# EAGLE design untitled (EAGLE 8.5.2)

## Sheet 1 of 3
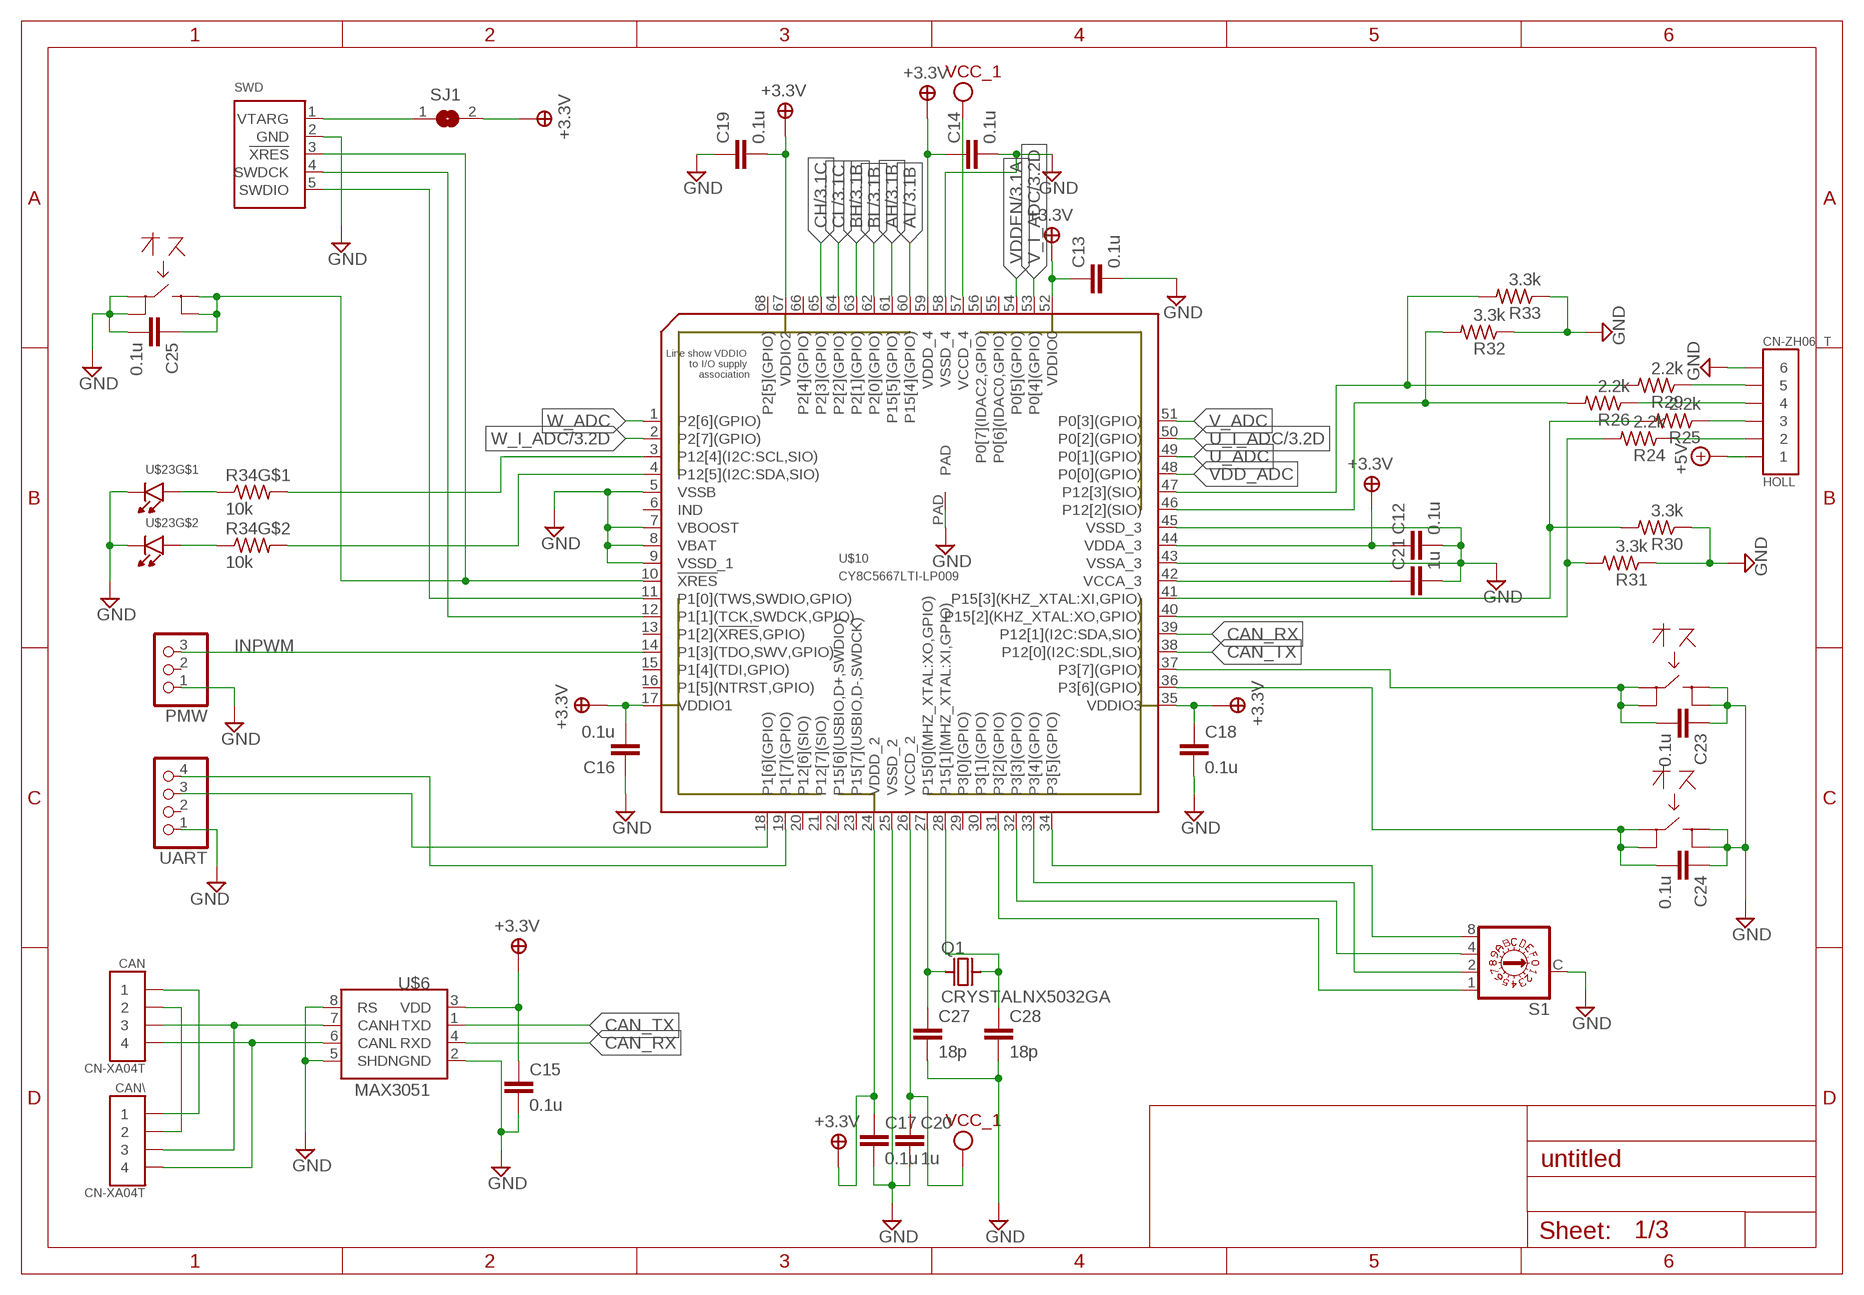
[diagram p0: schematic, sheet 1]

### Parts
C12  0.1u  CAPACITOR_1005M  [C1005]
C13  0.1u  CAPACITOR_1005M  [C1005]
C14  0.1u  CAPACITOR_1005M  [C1005]
C15  0.1u  CAPACITOR_1005M  [C1005]
C16  0.1u  CAPACITOR_1005M  [C1005]
C17  0.1u  CAPACITOR_1005M  [C1005]
C18  0.1u  CAPACITOR_1005M  [C1005]
C19  0.1u  CAPACITOR_1005M  [C1005]
C20  1u  CAPACITOR_1608M  [C1608]
C21  1u  CAPACITOR_1608M  [C1608]
C23  0.1u  CAPACITOR_1005M  [C1005]
C24  0.1u  CAPACITOR_1005M  [C1005]
C25  0.1u  CAPACITOR_1005M  [C1005]
C27  18p  CAPACITOR_1608M  [C1608]
C28  18p  CAPACITOR_1608M  [C1608]
CAN  CN-XA04T  [XA04]
CAN\  CN-XA04T  [XA04]
HOLL  CN-ZH06_T  [ZH06]
PMW  PINHD-1X03_2.54-S  [1X03-S]
Q1  CRYSTALNX5032GA  [NX5032GA]
R24  2.2k  R_1005  [R1005]
R25  2.2k  R_1005  [R1005]
R26  2.2k  R_1005  [R1005]
R29  2.2k  R_1005  [R1005]
R30  3.3k  R_1005  [R1005]
R31  3.3k  R_1005  [R1005]
R32  3.3k  R_1005  [R1005]
R33  3.3k  R_1005  [R1005]
R34  10k  R2_0402  [R1005*2]
RESET  SWITCH_4PALPS  [SKRP]
S1  P103_AKI  [SW_ROT_5]
SJ1  SJ  [SJ]
SWD  WRITE-FOR-PSOC3/4/5LP_ZH  [ZH05]
U$6  MAX3051  [SOIC8]
U$10  CY8C5667LTI-LP009  CY8C58LP_68  [QFN68_8X8]
U$23  LED2_SML522  [LED1315]
UART  PINHD-1X04_2.54-S  [1X04-S]
USER1  SWITCH_4PALPS  [SKRP]
USER2  SWITCH_4PALPS  [SKRP]

### Nets
3.3V: C12.1 C13.1 C14.1 C15.1 C16.2 C17.1 C18.1 C19.2 SJ1.2 U$6.3(VDD) U$10.17(VDDIO1) U$10.24(VDDD_2) U$10.35(VDDIO3) U$10.44(VDDA_3) U$10.52(VDDIO0) U$10.59(VDDD_4) U$10.67(VDDIO2) ; supply symbol labelled +3.3V ; also sheet 2,3
+5V: HOLL.1 ; also sheet 2
AH: U$10.61(P15[5](GPIO)) ; also sheet 3
AL: U$10.60(P15[4](GPIO)) ; also sheet 3
BH: U$10.63(P2[1](GPIO)) ; also sheet 3
BL: U$10.62(P2[0](GPIO)) ; also sheet 3
CAN_RX: U$6.4(RXD) U$10.39(P12[1](I2C:SDA,SIO))
CAN_TX: U$6.1(TXD) U$10.38(P12[0](I2C:SDL,SIO))
CH: U$10.65(P2[3](GPIO)) ; also sheet 3
CL: U$10.64(P2[2](GPIO)) ; also sheet 3
GND: C12.2 C13.2 C14.2 C15.2 C16.1 C17.2 C18.2 C19.1 C20.2 C21.2 C23.1 C24.1 C25.2 C27.2 C28.2 HOLL.6 PMW.1 R30.1 R31.1 R32.1 R33.1 RESET.1 RESET.2 S1.C SWD.2(GND) U$6.2(GND) U$6.5(SHDN) U$6.8(RS) U$10.5(VSSB) U$10.7(VBOOST) U$10.8(VBAT) U$10.9(VSSD_1) U$10.25(VSSD_2) U$10.43(VSSA_3) U$10.45(VSSD_3) U$10.58(VSSD_4) U$10.PAD U$23.2(C) U$23.4(C) UART.1 USER1.3 USER1.4 USER2.3 USER2.4 ; also sheet 2,3
INPWM: PMW.3 U$10.14(P1[3](TDO,SWV,GPIO))
N$1: U$10.18(P1[6](GPIO)) UART.3
N$2: S1.8 U$10.34(P3[5](GPIO))
N$3: R29.2 R33.2 U$10.47(P12[3](SIO))
N$11: C21.1 U$10.42(VCCA_3)
N$13: CAN.PIN1 CAN\.PIN1
N$15: CAN.PIN2 CAN\.PIN2
N$17: CAN.PIN3 CAN\.PIN3 U$6.7(CANH)
N$20: CAN.PIN4 CAN\.PIN4 U$6.6(CANL)
N$23: C23.2 U$10.37(P3[7](GPIO)) USER1.1 USER1.2
N$30: C24.2 U$10.36(P3[6](GPIO)) USER2.1 USER2.2
N$32: SWD.5(SWDIO) U$10.11(P1[0](TWS,SWDIO,GPIO))
N$33: SWD.4(SWDCK) U$10.12(P1[1](TCK,SWDCK,GPIO))
N$34: C27.1 Q1.1 U$10.27(P15[0](MHZ_XTAL:XO,GPIO))
N$35: C28.1 Q1.2 U$10.28(P15[1](MHZ_XTAL:XI,GPIO))
N$37: C25.1 RESET.3 RESET.4 SWD.3(!XRES) U$10.10(!XRES)
N$41: U$10.19(P1[7](GPIO)) UART.4
N$42: S1.4 U$10.32(P3[3](GPIO))
N$46: S1.1 U$10.31(P3[2](GPIO))
N$55: R26.2 R32.2 U$10.46(P12[2](SIO))
N$56: S1.2 U$10.33(P3[4](GPIO))
N$57: R24.2 R31.2 U$10.40(P15[2](KHZ_XTAL:XO,GPIO))
N$58: R25.2 R30.2 U$10.41(P15[3](KHZ_XTAL:XI,GPIO))
N$59: HOLL.2 R24.1
N$60: HOLL.3 R25.1
N$61: HOLL.4 R26.1
N$62: HOLL.5 R29.1
N$63: SJ1.1 SWD.1(VTARG)
N$64: R34.A1 U$23.1(A)
N$65: R34.B1 U$23.3(A)
N$66: R34.B2 U$10.4(P12[5](I2C:SDA,SIO))
N$67: R34.A2 U$10.3(P12[4](I2C:SCL,SIO))
U_ADC: U$10.49(P0[1](GPIO)) ; also sheet 3
U_I_ADC: U$10.50(P0[2](GPIO)) ; also sheet 3
V_ADC: U$10.51(P0[3](GPIO)) ; also sheet 3
V_I_ADC: U$10.53(P0[4](GPIO)) ; also sheet 3
VCC_1: C20.1 U$10.26(VCCD_2) U$10.57(VCCD_4)
VDD_ADC: U$10.48(P0[0](GPIO)) ; also sheet 3
VDDEN: U$10.54(P0[5](GPIO)) ; also sheet 3
W_ADC: U$10.1(P2[6](GPIO)) ; also sheet 3
W_I_ADC: U$10.2(P2[7](GPIO)) ; also sheet 3
Unconnected: PMW.2 U$10.6(IND) U$10.13(P1[2](!XRES,GPIO)) U$10.15(P1[4](TDI,GPIO)) U$10.16(P1[5](NTRST,GPIO)) U$10.20(P12[6](SIO)) U$10.21(P12[7](SIO)) U$10.22(P15[6](USBIO,D+,SWDIO)) U$10.23(P15[7](USBIO,D-,SWDCK)) U$10.29(P3[0](GPIO)) U$10.30(P3[1](GPIO)) U$10.55(P0[6](IDAC0,GPIO)) U$10.56(P0[7](IDAC2,GPIO)) U$10.66(P2[4](GPIO)) U$10.68(P2[5](GPIO)) UART.2

## Sheet 2 of 3
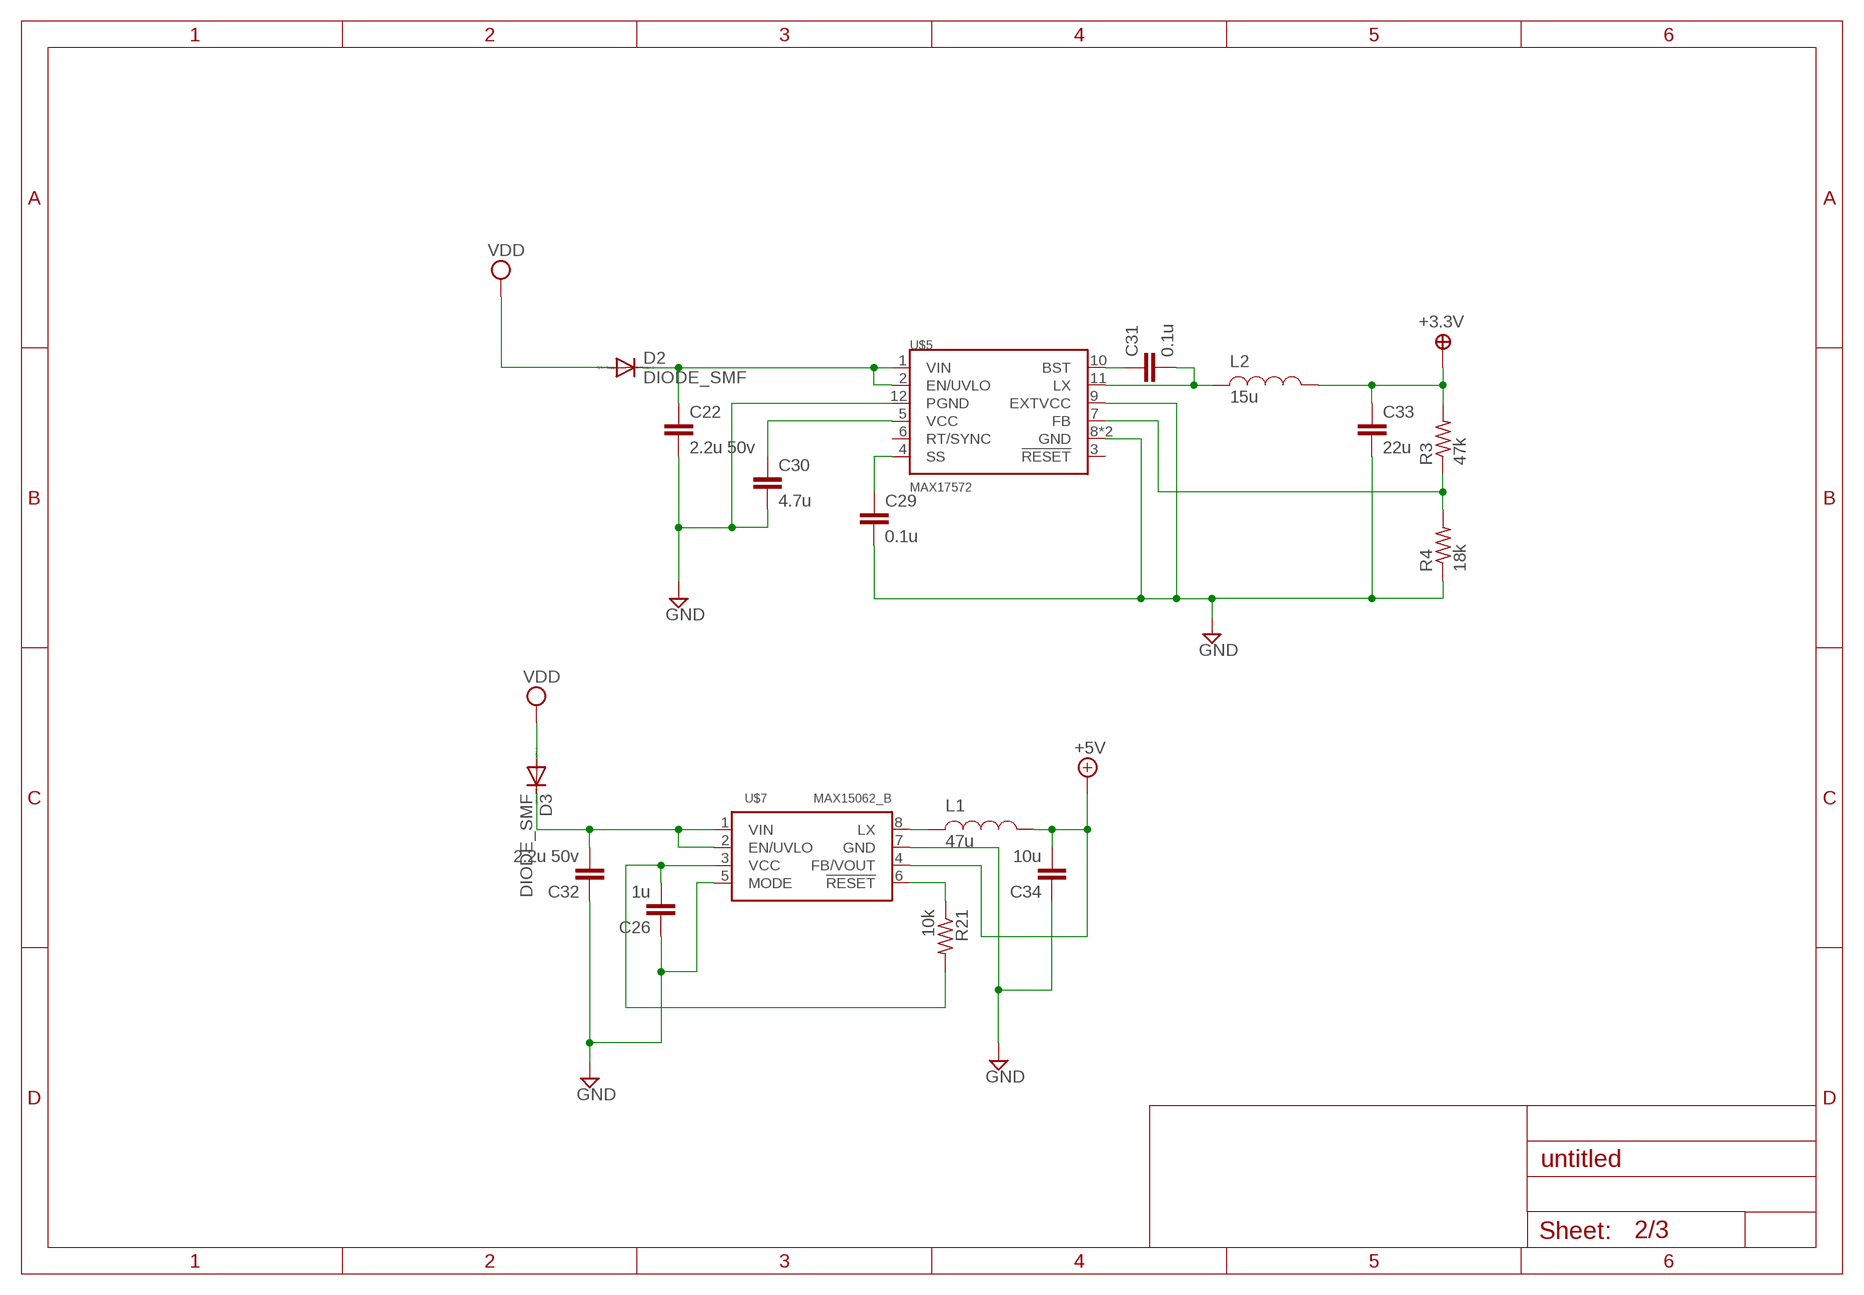
[diagram p1: schematic, sheet 2]

### Parts
C22  2.2u 50v  CAPACITOR_3216M  [C3216]
C26  1u  CAPACITOR_1608M  [C1608]
C29  0.1u  CAPACITOR_1005M  [C1005]
C30  4.7u  CAPACITOR_2012M  [C2012]
C31  0.1u  CAPACITOR_1005M  [C1005]
C32  2.2u 50v  CAPACITOR_3216M  [C3216]
C33  22u  CAPACITOR_3216M  [C3216]
C34  10u  CAPACITOR_1608M  [C1608]
D2  DIODE_SMF  [DO-219AB(SMF)]
D3  DIODE_SMF  [DO-219AB(SMF)]
L1  47u  INDUCTOR_BRC2518  [L2518]
L2  15u  INDUCTOR_150M  [SRN4018]
R3  47k  R_1005  [R1005]
R4  18k  R_1005  [R1005]
R21  10k  R_1005  [R1005]
U$5  MAX17572  [TDFN12-3X3]
U$7  MAX15062_B  MAX15062_A  [TDFN08_2X2(NO_BOTTOM)]

### Nets
3.3V: C33.1 L2.P$2 R3.2 ; supply symbol labelled +3.3V ; also sheet 1,3
+5V: C34.2 L1.P$2 U$7.4(FB/VOUT) ; also sheet 1
GND: C22.2 C26.1 C29.2 C30.2 C32.1 C33.2 C34.1 R4.1 U$5.8(GND) U$5.9(EXTVCC) U$5.12(PGND) U$5.EPAD(GND) U$7.5(MODE) U$7.7(GND) ; also sheet 1,3
N$12: C32.2 D3.C U$7.1(VIN) U$7.2(EN/UVLO)
N$28: C22.1 D2.C U$5.1(VIN) U$5.2(EN/UVLO)
N$36: C29.1 U$5.4(SS)
N$38: C30.1 U$5.5(VCC)
N$39: R3.1 R4.2 U$5.7(FB)
N$43: C31.2 L2.P$1 U$5.11(LX)
N$44: C31.1 U$5.10(BST)
N$47: C26.2 R21.2 U$7.3(VCC)
N$49: R21.1 U$7.6(!RESET)
N$51: L1.P$1 U$7.8(LX)
VDD: D2.A D3.A ; also sheet 3
Unconnected: U$5.3(!RESET) U$5.6(RT/SYNC)

## Sheet 3 of 3
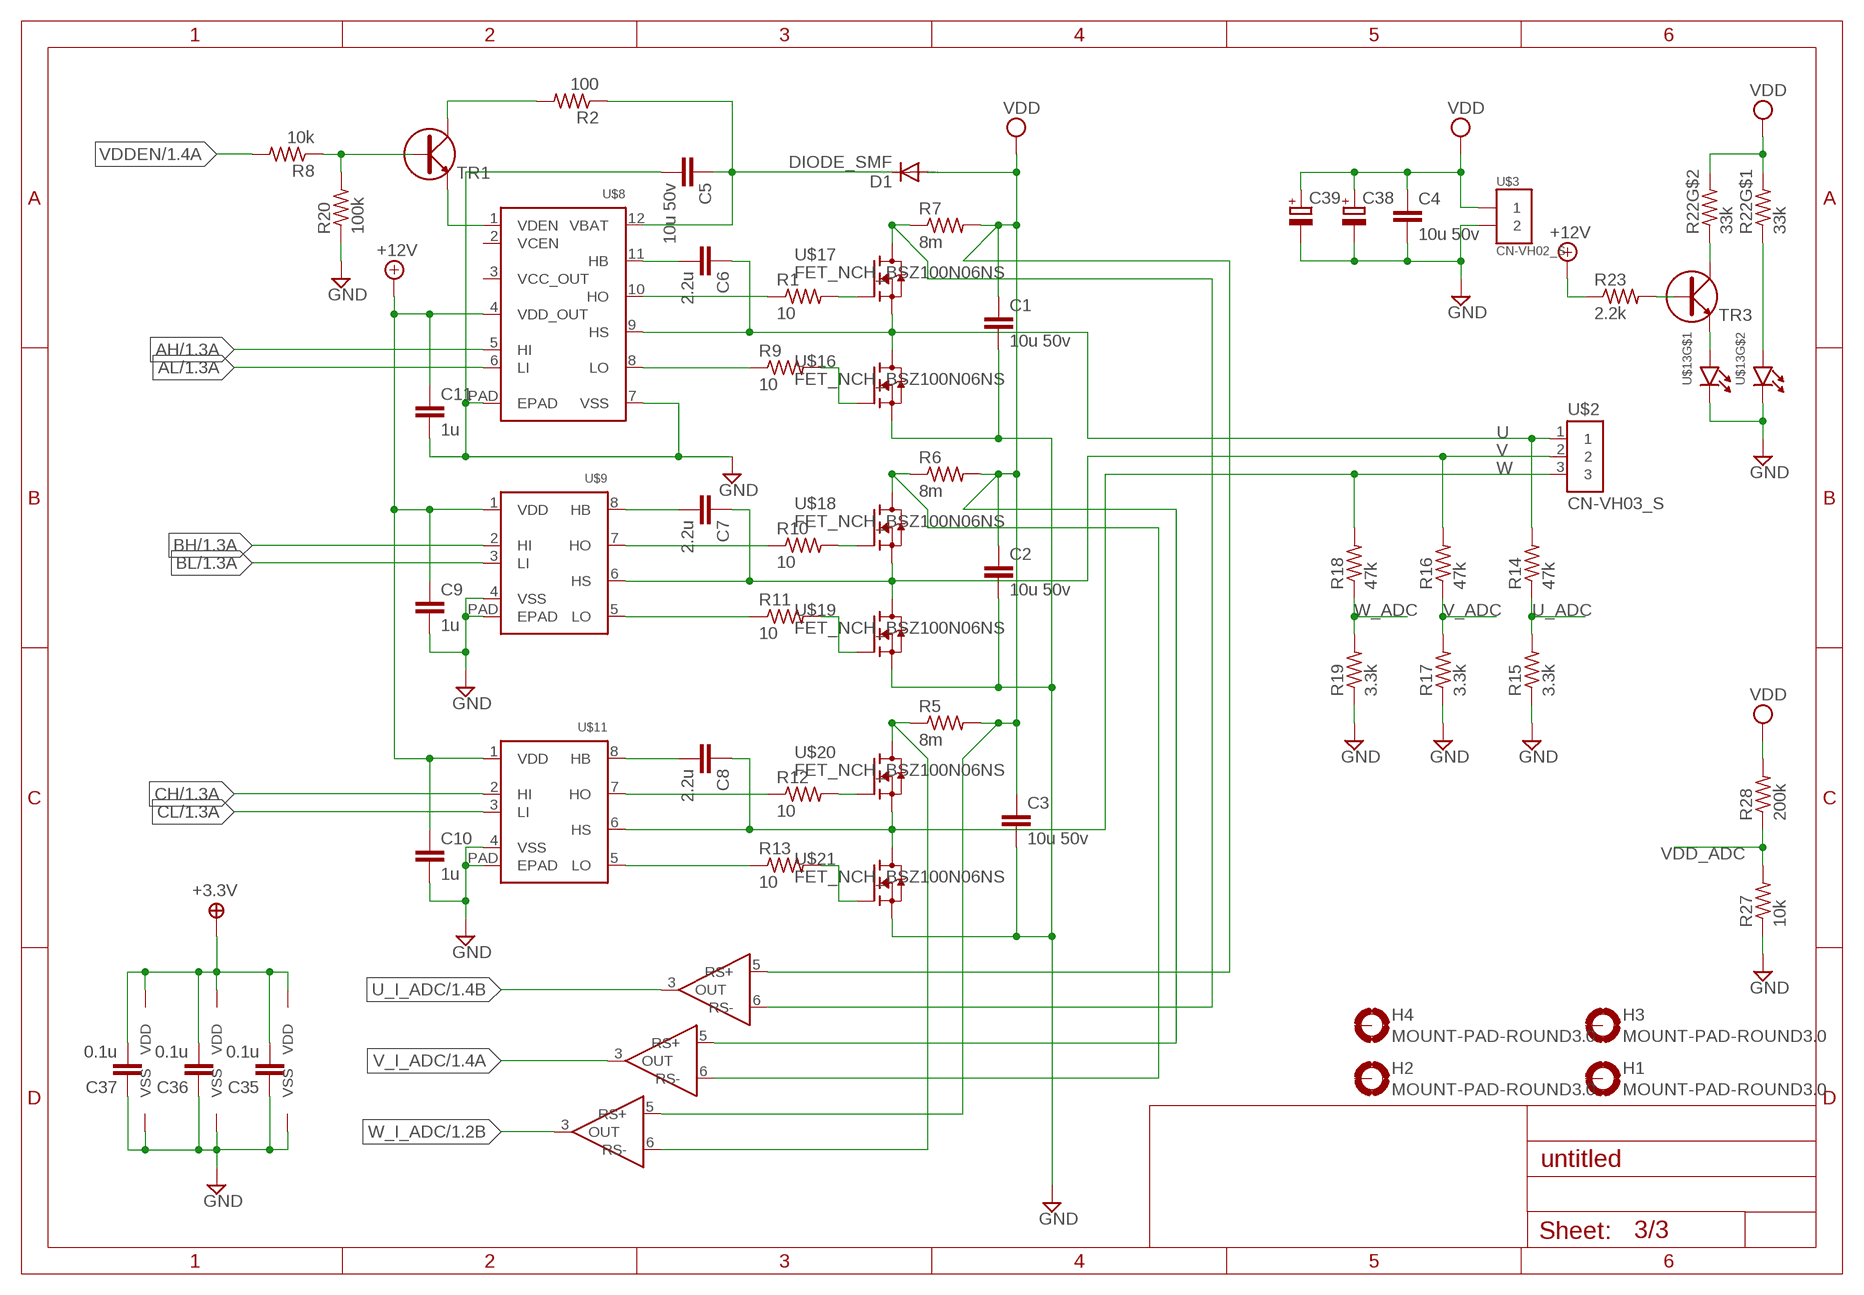
[diagram p2: schematic, sheet 3]

### Parts
C1  10u 50v  CAPACITOR_3216M  [C3216]
C2  10u 50v  CAPACITOR_3216M  [C3216]
C3  10u 50v  CAPACITOR_3216M  [C3216]
C4  10u 50v  CAPACITOR_3216M  [C3216]
C5  10u 50v  CAPACITOR_3216M  [C3216]
C6  2.2u  CAPACITOR_1005M  [C1005]
C7  2.2u  CAPACITOR_1005M  [C1005]
C8  2.2u  CAPACITOR_1005M  [C1005]
C9  1u  CAPACITOR_1608M  [C1608]
C10  1u  CAPACITOR_1608M  [C1608]
C11  1u  CAPACITOR_1608M  [C1608]
C35  0.1u  CAPACITOR_1005M  [C1005]
C36  0.1u  CAPACITOR_1005M  [C1005]
C37  0.1u  CAPACITOR_1005M  [C1005]
C38  CPOL-EUG  [PANASONIC_G]
C39  CPOL-EUE5-13  [E5-13]
D1  DIODE_SMF  [DO-219AB(SMF)]
H1  MOUNT-PAD-ROUND3.0  [3,0-PAD]
H2  MOUNT-PAD-ROUND3.0  [3,0-PAD]
H3  MOUNT-PAD-ROUND3.0  [3,0-PAD]
H4  MOUNT-PAD-ROUND3.0  [3,0-PAD]
R1  10  R_1608  [R1608]
R2  100  R_1005  [R1005]
R5  8m  R_3216  [R3216]
R6  8m  R_3216  [R3216]
R7  8m  R_3216  [R3216]
R8  10k  R_1005  [R1005]
R9  10  R_1608  [R1608]
R10  10  R_1608  [R1608]
R11  10  R_1608  [R1608]
R12  10  R_1608  [R1608]
R13  10  R_1608  [R1608]
R14  47k  R_1005  [R1005]
R15  3.3k  R_1005  [R1005]
R16  47k  R_1005  [R1005]
R17  3.3k  R_1005  [R1005]
R18  47k  R_1005  [R1005]
R19  3.3k  R_1005  [R1005]
R20  100k  R_1005  [R1005]
R22  33k  R2_0402  [R1005*2]
R23  2.2k  R_1005  [R1005]
R27  10k  R_1005  [R1005]
R28  200k  R_1005  [R1005]
TR1  TR_NTR  [SOT-23-3]
TR3  TR_NTR  [SOT-23-3]
U$2  CN-VH03_S  [VH03-S]
U$3  CN-VH02_S  [VH02-S]
U$8  HIP2104  [DFN_4X4_12LD]
U$9  HIP2103  [DFN_3X3_8L]
U$11  HIP2103  [DFN_3X3_8L]
U$13  LED2_SML522  [LED1315]
U$14  MAX40010  [SOT-23-6]
U$15  MAX40010  [SOT-23-6]
U$16  FET_NCH_BSZ100N06NS  [TSDSON-8]
U$17  FET_NCH_BSZ100N06NS  [TSDSON-8]
U$18  FET_NCH_BSZ100N06NS  [TSDSON-8]
U$19  FET_NCH_BSZ100N06NS  [TSDSON-8]
U$20  FET_NCH_BSZ100N06NS  [TSDSON-8]
U$21  FET_NCH_BSZ100N06NS  [TSDSON-8]
U$22  MAX40010  [SOT-23-6]

### Nets
3.3V: C35.2 C36.2 C37.2 U$14.4(VDD) U$15.4(VDD) U$22.4(VDD) ; supply symbol labelled +3.3V ; also sheet 1,2
+12V: C9.1 C10.1 C11.1 R23.1 U$8.4(VDD_OUT) U$9.1(VDD) U$11.1(VDD)
AH: U$8.5(HI) ; also sheet 1
AL: U$8.6(LI) ; also sheet 1
BH: U$9.2(HI) ; also sheet 1
BL: U$9.3(LI) ; also sheet 1
CH: U$11.2(HI) ; also sheet 1
CL: U$11.3(LI) ; also sheet 1
GND: C1.2 C2.2 C3.2 C4.2 C5.2 C9.2 C10.2 C11.2 C35.1 C36.1 C37.1 C38.- C39.- R15.1 R17.1 R19.1 R20.1 R27.1 U$3.1 U$8.7(VSS) U$8.PAD(EPAD) U$9.4(VSS) U$9.PAD(EPAD) U$11.4(VSS) U$11.PAD(EPAD) U$13.2(C) U$13.4(C) U$14.2(VSS) U$15.2(VSS) U$16.1(S) U$16.2(S) U$16.3(S) U$16.123(S) U$19.1(S) U$19.2(S) U$19.3(S) U$19.123(S) U$21.1(S) U$21.2(S) U$21.3(S) U$21.123(S) U$22.2(VSS) ; also sheet 1,2
N$4: R13.2 U$21.4(G)
N$5: R13.1 U$11.5(LO)
N$6: R11.2 U$19.4(G)
N$7: R12.1 U$11.7(HO)
N$8: R9.2 U$16.4(G)
N$9: R12.2 U$20.4(G)
N$10: R6.1 U$15.6(RS-) U$18.5(D) U$18.6(D) U$18.7(D) U$18.8(D) U$18.5678(D)
N$14: C8.2 U$11.8(HB)
N$16: C7.2 U$9.8(HB)
N$18: C6.2 U$8.11(HB)
N$19: R5.1 U$20.5(D) U$20.6(D) U$20.7(D) U$20.8(D) U$20.5678(D) U$22.6(RS-)
N$21: TR1.2(E) U$8.1(VDEN)
N$22: R8.1 R20.2 TR1.1(B)
N$24: R11.1 U$9.5(LO)
N$25: R10.2 U$18.4(G)
N$26: R10.1 U$9.7(HO)
N$27: R9.1 U$8.8(LO)
N$29: R2.2 TR1.3(C)
N$31: R7.1 U$14.6(RS-) U$17.5(D) U$17.6(D) U$17.7(D) U$17.8(D) U$17.5678(D)
N$40: C5.1 D1.C R2.1 U$8.12(VBAT)
N$45: R23.2 TR3.1(B)
N$48: R1.2 U$17.4(G)
N$50: R1.1 U$8.10(HO)
N$52: R22.B1 TR3.3(C)
N$53: TR3.2(E) U$13.1(A)
N$54: R22.A1 U$13.3(A)
U: C6.1 R14.2 U$2.1 U$8.9(HS) U$16.5(D) U$16.6(D) U$16.7(D) U$16.8(D) U$16.5678(D) U$17.1(S) U$17.2(S) U$17.3(S) U$17.123(S)
U_ADC: R14.1 R15.2 ; also sheet 1
U_I_ADC: U$14.3(OUT) ; also sheet 1
V: C7.1 R16.2 U$2.2 U$9.6(HS) U$18.1(S) U$18.2(S) U$18.3(S) U$18.123(S) U$19.5(D) U$19.6(D) U$19.7(D) U$19.8(D) U$19.5678(D)
V_ADC: R16.1 R17.2 ; also sheet 1
V_I_ADC: U$15.3(OUT) ; also sheet 1
VDD: C1.1 C2.1 C3.1 C4.1 C38.+ C39.+ D1.A R5.2 R6.2 R7.2 R22.A2 R22.B2 R28.2 U$3.2 U$14.5(RS+) U$15.5(RS+) U$22.5(RS+) ; also sheet 2
VDD_ADC: R27.2 R28.1 ; also sheet 1
VDDEN: R8.2 ; also sheet 1
W: C8.1 R18.2 U$2.3 U$11.6(HS) U$20.1(S) U$20.2(S) U$20.3(S) U$20.123(S) U$21.5(D) U$21.6(D) U$21.7(D) U$21.8(D) U$21.5678(D)
W_ADC: R18.1 R19.2 ; also sheet 1
W_I_ADC: U$22.3(OUT) ; also sheet 1
Unconnected: H1.B3,0(MOUNT) H2.B3,0(MOUNT) H3.B3,0(MOUNT) H4.B3,0(MOUNT) U$8.2(VCEN) U$8.3(VCC_OUT)

## Library data of the parts
C1-C37 = Shohei:CAPACITOR
C38 C39 = rcl:CPOL-EU: POLARIZED CAPACITOR, European symbol
CAN CAN\ = Shohei:CN-XA04
D1-D3 = Shohei:DIODE
H1-H4 = Shohei:MOUNT-PAD-ROUND: MOUNTING PAD, round
HOLL = Shohei:CN-ZH06
L1 L2 = Shohei:INDUCTOR
PMW = pinhead-2:PINHD-1X03: PIN HEADER
Q1 = Shohei:CRYSTAL
R1-R21 R23-R33 = Shohei:R
R22 R34 = Shohei:R*2
RESET USER1 USER2 = Shohei:SWITCH_4P
S1 = Shohei:P103: DIL/CODE SWITCH
SJ1 = Shohei:SJ: SMD solder JUMPER
SWD = Shohei:WRITE-FOR-PSOC3/4/5LP
TR1 TR3 = Shohei:TR_N
U$2 = Shohei:CN-VH03
U$3 = Shohei:CN-VH02
U$5 = Shohei:MAX17572
U$6 = Shohei:MAX3051
U$7 = Shohei:MAX15062
U$8 = Shohei:HIP2104
U$9 U$11 = Shohei:HIP2103
U$10 = Shohei:CY8C58LP_68
U$13 U$23 = Shohei:LED*2
U$14 U$15 U$22 = Shohei:MAX40010
U$16-U$21 = Shohei:FET_NCH
UART = pinhead-2:PINHD-1X04: PIN HEADER

## Board
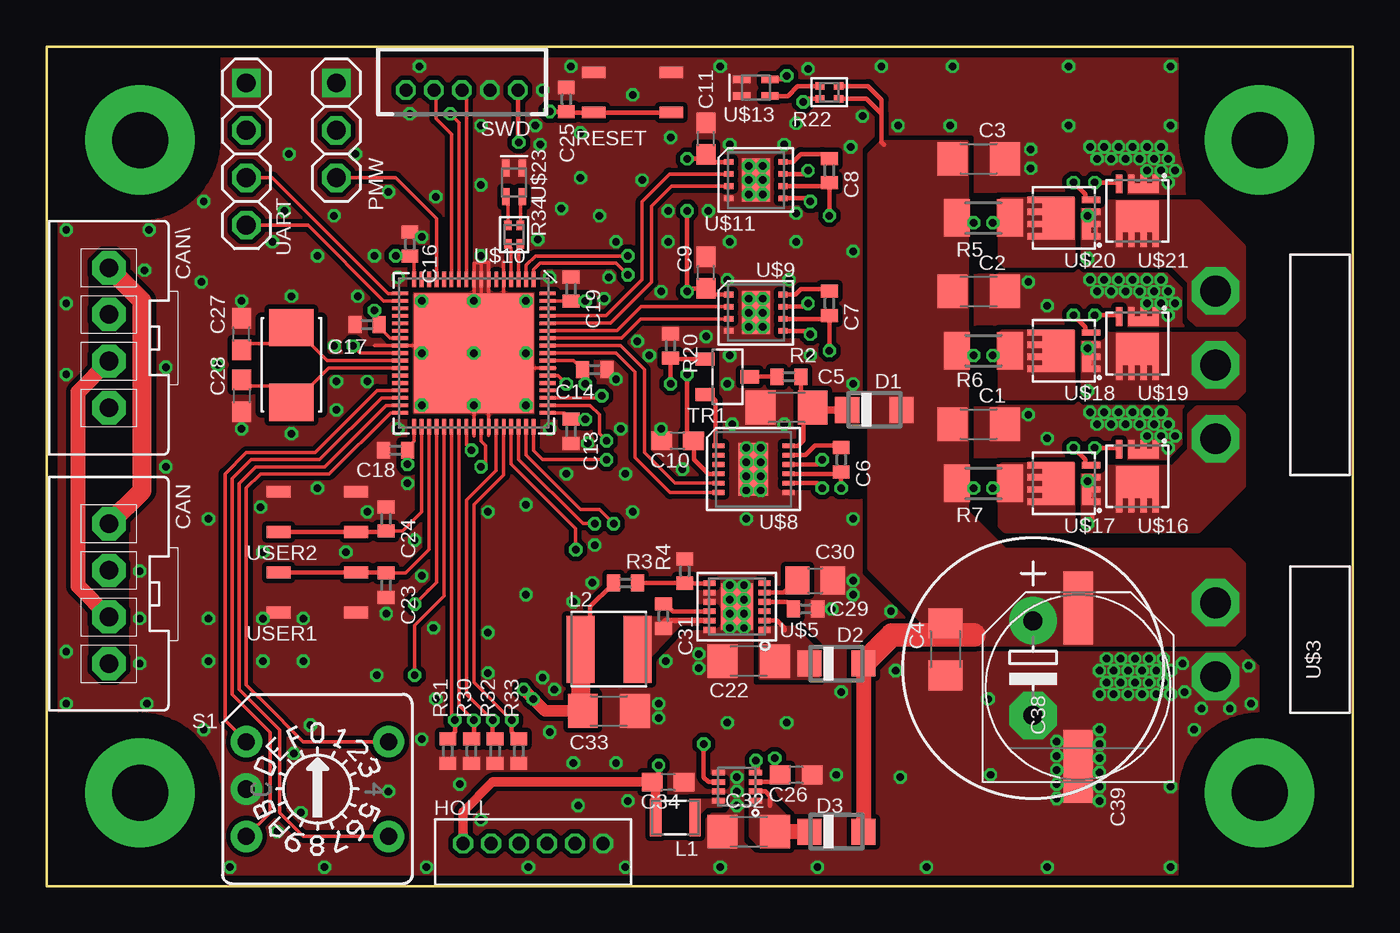
[diagram p3: board, top side]
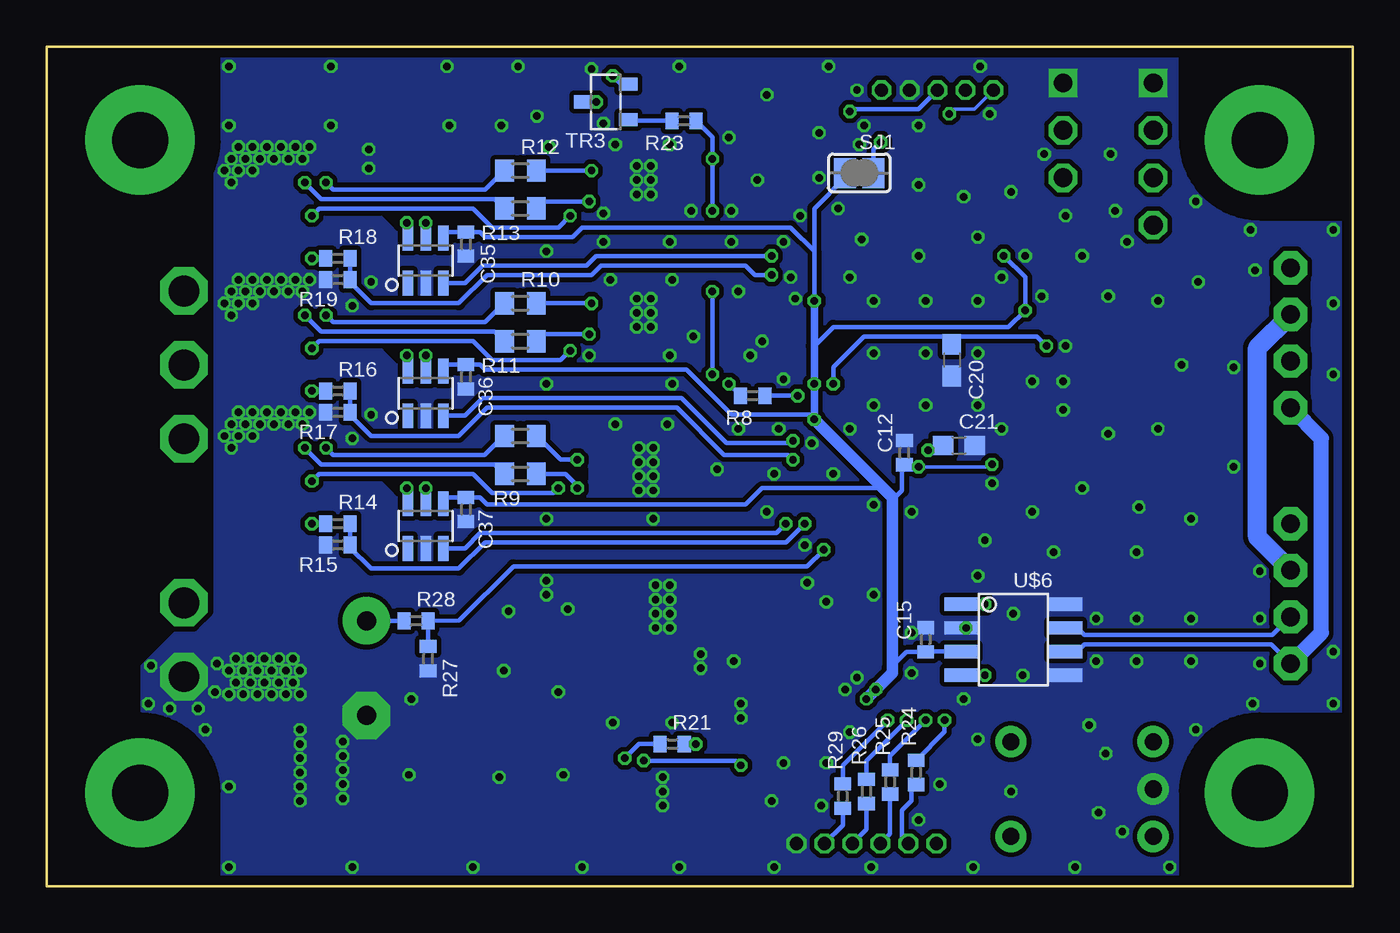
[diagram p4: board, bottom side, seen from below]

Size 70 x 45 mm. Coordinates in mm from the lower left corner, seen from the top.
Outline: 0,0 23,0
Outline: 25,0 70,0
Outline: 70,45 25,45
Outline: 70,45 0,45 0,0
Outline: 70,45 70,0
Outline: 70,0 0,0
Copper layers (1*16): Top 0.035mm / dielectric 1.6mm / Bottom 0.035mm
Design rules "Elecrow_2-layer_PCB_eagle_rule": minimum track width 6mil, minimum drill 12mil, track to track 6mil, track to pad 6mil, pad to pad 6mil, via to via 8mil, smd to smd 0mil, copper to edge 20mil, drill to drill 10mil, minimum pad ring 6mil, minimum via ring 6mil, stop-mask expansion 0mil, vias tented up to drill 100mil, thermal gap 10mil
tRestrict: 38 lines
bRestrict: 39 lines

### Footprints (pad centres in the part's own frame; a part is rotated, then mirrored left to right if it is on the bottom)
C3216 = smd 1.6 x 1.8: 1 -1.4,0; 2 1.4,0
C1005 = smd 0.7 x 0.9: 1 -0.65,0; 2 0.65,0
C1608 = smd 1.1 x 1: 1 -0.85,0; 2 0.85,0
C2012 = smd 1.3 x 1.5: 1 -0.95,0; 2 0.95,0
PANASONIC_G = smd 3.9 x 1.6: + 4.25,0; - -4.25,0
E5-13 = drill 1.016 pad 2.54: + -2.54,0 | drill 1.016 pad 2.54 octagon: - 2.54,0
XA04 = drill 1 pad 1.778 octagon: PIN1 0,0; PIN2 -2.5,0; PIN3 -5,0; PIN4 -7.5,0
DO-219AB(SMF) = smd 1.3 x 1.4: A 1.45,0; C -1.45,0
3,0-PAD = drill 3 pad 5.842: B3,0 0,0
ZH06 = drill 0.7 octagon: 1 3.75,0; 2 2.25,0; 3 0.75,0; 4 -0.75,0; 5 -2.25,0; 6 -3.75,0
L2518 = smd 0.6 x 2: P$1 -1.05,0; P$2 1.05,0
SRN4018 = smd 1.5 x 3.6: P$1 -1.525,0; P$2 1.525,0
1X03-S = drill 1.016 square: 1 -2.54,0 | drill 1.016 octagon: 2 0,0; 3 2.54,0
NX5032GA = smd 2 x 2.4: 1 -2,0; 2 2,0
R1608 = smd 1 x 1.2: 1 -0.85,0; 2 0.85,0
R1005 = smd 0.7 x 0.9: 1 -0.65,0; 2 0.65,0
R3216 = smd 1.4 x 2: 1 -1.422,0; 2 1.422,0
R1005*2 = smd 0.4 x 0.5: A1 -0.338,-0.5; A2 -0.338,0.5; B1 0.338,-0.5; B2 0.338,0.5
SKRP = smd 1.27 x 0.635: 1 -2.075,1.075; 2 2.075,1.075; 3 -2.075,-1.075; 4 2.075,-1.075
SW_ROT_5 = drill 0.914 pad 1.676: 1 3.81,-2.54; 2 -3.81,2.54; 4 3.81,2.54; 8 -3.81,-2.54; C 3.81,0
SJ = smd 1.168 x 1.6: 1 -0.762,0; 2 0.762,0
ZH05 = drill 0.7 octagon: 1 3,0; 2 1.5,0; 3 0,0; 4 -1.5,0; 5 -3,0
SOT-23-3 = smd 0.7 x 1: 1 -0.95,-1.2; 2 0.95,-1.2; 3 0,1.2
VH03-S = drill 1.65 pad 2.54 octagon: 1 3.96,0; 2 0,0; 3 -3.96,0
VH02-S = drill 1.65 pad 2.54 octagon: 1 1.98,0; 2 -1.98,0
TDFN12-3X3 = smd 0.65 x 0.3: 1 -1.475,1.25; 2 -1.475,0.75; 3 -1.475,0.25; 4 -1.475,-0.25; 5 -1.475,-0.75; 6 -1.475,-1.25; 7 1.475,-1.25; 8 1.475,-0.75; 9 1.475,-0.25; 10 1.475,0.25; 11 1.475,0.75; 12 1.475,1.25 | smd 1.7 x 2.5: EPAD 0,0
SOIC8 = smd 0.72 x 1.78: 1 -1.905,-2.8; 2 -0.635,-2.8; 3 0.635,-2.8; 4 1.905,-2.8; 5 1.905,2.8; 6 0.635,2.8; 7 -0.635,2.8; 8 -1.905,2.8
TDFN08_2X2(NO_BOTTOM) = smd 0.3 x 0.7: 1 -0.75,-0.99; 2 -0.25,-0.99; 3 0.25,-0.99; 4 0.75,-0.99; 5 0.75,0.99; 6 0.25,0.99; 7 -0.25,0.99; 8 -0.75,0.99
DFN_4X4_12LD = smd 0.25 x 0.65: 1 1.25,1.875; 2 0.75,1.875; 3 0.25,1.875; 4 -0.25,1.875; 5 -0.75,1.875; 6 -1.25,1.875; 7 -1.25,-1.875; 8 -0.75,-1.875; 9 -0.25,-1.875; 10 0.25,-1.875; 11 0.75,-1.875; 12 1.25,-1.875 | smd 2.8 x 1.58: PAD 0,0
DFN_3X3_8L = smd 0.3 x 0.5: 1 0.975,1.45; 2 0.325,1.45; 3 -0.325,1.45; 4 -0.975,1.45; 5 -0.975,-1.45; 6 -0.325,-1.45; 7 0.325,-1.45; 8 0.975,-1.45 | smd 2.3 x 1.5: PAD 0,0
QFN68_8X8 = smd 0.85 x 0.2: 1 -3.95,3.2; 2 -3.95,2.8; 3 -3.95,2.4; 4 -3.95,2; 5 -3.95,1.6; 6 -3.95,1.2; 7 -3.95,0.8; 8 -3.95,0.4; 9 -3.95,0; 10 -3.95,-0.4; 11 -3.95,-0.8; 12 -3.95,-1.2; 13 -3.95,-1.6; 14 -3.95,-2; 15 -3.95,-2.4; 16 -3.95,-2.8; 17 -3.95,-3.2; 35 3.95,-3.2; 36 3.95,-2.8; 37 3.95,-2.4; 38 3.95,-2; 39 3.95,-1.6; 40 3.95,-1.2; 41 3.95,-0.8; 42 3.95,-0.4; 43 3.95,0; 44 3.95,0.4; 45 3.95,0.8; 46 3.95,1.2; 47 3.95,1.6; 48 3.95,2; 49 3.95,2.4; 50 3.95,2.8; 51 3.95,3.2 | smd 0.2 x 0.85: 18 -3.2,-3.95; 19 -2.8,-3.95; 20 -2.4,-3.95; 21 -2,-3.95; 22 -1.6,-3.95; 23 -1.2,-3.95; 24 -0.8,-3.95; 25 -0.4,-3.95; 26 0,-3.95; 27 0.4,-3.95; 28 0.8,-3.95; 29 1.2,-3.95; 30 1.6,-3.95; 31 2,-3.95; 32 2.4,-3.95; 33 2.8,-3.95; 34 3.2,-3.95; 52 3.2,3.95; 53 2.8,3.95; 54 2.4,3.95; 55 2,3.95; 56 1.6,3.95; 57 1.2,3.95; 58 0.8,3.95; 59 0.4,3.95; 60 0,3.95; 61 -0.4,3.95; 62 -0.8,3.95; 63 -1.2,3.95; 64 -1.6,3.95; 65 -2,3.95; 66 -2.4,3.95; 67 -2.8,3.95; 68 -3.2,3.95 | smd 6.4 x 6.4: PAD 0,0
LED1315 = smd 0.925 x 0.4: 1 0.762,0.45; 2 -0.762,0.45; 3 0.762,-0.45; 4 -0.762,-0.45
SOT-23-6 = smd 1.33 x 0.56: 1 -1.2,0.95; 2 -1.2,0; 3 -1.2,-0.95; 4 1.2,-0.95; 5 1.2,0; 6 1.2,0.95
TSDSON-8 = smd 0.34 x 0.5: 1 -0.975,-1.7; 2 -0.325,-1.7; 3 0.325,-1.7 | smd 0.34 x 1: 4 0.975,-1.45 | smd 0.34 x 0.8: 5 0.975,1.55; 6 0.325,1.55; 7 -0.325,1.55; 8 -0.975,1.55 | smd 1.64 x 0.5: 123 -0.325,-1.2 | smd 2.29 x 1.71: 5678 0,0.295
1X04-S = drill 1.016 square: 1 -3.81,0 | drill 1.016 octagon: 2 -1.27,0; 3 1.27,0; 4 3.81,0

### Placement (x,y rotation side)
C1  49.94,24.77 0 top
C2  49.94,31.88 0 top
C3  49.94,38.99 0 top
C4  48.17,12.7 270 top
C5  39.66,25.65 180 top
C6  42.58,22.86 90 top
C7  41.94,31.24 90 top
C8  41.94,38.35 90 top
C9  35.34,32.89 90 top
C10  33.81,23.88 180 top
C11  35.34,40.07 90 top
C12  24.04,23.24 90 bottom
C13  28.1,24.38 270 top
C14  29.37,27.69 0 top
C15  22.89,13.21 90 bottom
C16  19.46,34.42 270 top
C17  17.18,30.1 180 top
C18  18.7,23.37 180 top
C19  28.1,32 270 top
C20  21.5,28.19 270 bottom
C21  21.11,23.62 0 bottom
C22  37.62,12.06 180 top
C23  18.19,16.13 90 top
C24  18.19,19.68 270 top
C25  27.85,42.16 90 top
C26  40.16,5.97 180 top
C27  10.45,29.59 90 top
C28  10.45,26.29 270 top
C29  40.67,14.86 0 top
C30  41.18,16.38 0 top
C31  33.05,14.48 270 top
C32  37.62,2.92 0 top
C33  30.13,9.4 0 top
C34  33.31,5.59 180 top
C35  47.53,34.42 90 bottom
C36  47.53,27.3 90 bottom
C37  47.53,20.19 90 bottom
C38  55.28,10.67 90 top
C39  52.87,11.68 270 top
CAN  3.34,19.43 90 top
CAN\  3.34,33.15 90 top
D1  44.36,25.53 0 top
D2  42.32,11.94 0 top
D3  42.32,2.92 0 top
H1  5,5 0 top
H2  5,40 0 top
H3  65,40 0 top
H4  65,5 0 top
HOLL  26.07,2.29 180 top
L1  33.69,3.68 180 top
L2  30.13,12.7 180 top
PMW  15.53,40.51 270 top
Q1  13.11,27.94 270 top
R1  44.61,24.13 180 bottom
R2  39.78,27.3 180 top
R3  31.02,16.26 180 top
R4  34.2,16.89 270 top
R5  50.2,35.81 180 top
R6  50.2,28.7 180 top
R7  50.2,21.59 180 top
R8  32.16,26.29 0 bottom
R9  44.61,22.1 180 bottom
R10  44.61,31.24 180 bottom
R11  44.61,29.21 180 bottom
R12  44.61,38.35 180 bottom
R13  44.61,36.32 180 bottom
R14  54.39,19.43 180 bottom
R15  54.39,18.29 0 bottom
R16  54.39,26.54 180 bottom
R17  54.39,25.4 0 bottom
R18  54.39,33.66 180 bottom
R19  54.39,32.51 0 bottom
R20  33.43,28.96 270 top
R21  36.48,7.62 180 bottom
R22  41.94,42.55 270 top
R23  35.85,41.02 180 bottom
R24  23.4,6.1 90 bottom
R25  24.8,5.59 90 bottom
R26  26.07,5.08 90 bottom
R27  49.56,12.19 90 bottom
R28  50.2,14.22 180 bottom
R29  27.34,4.83 90 bottom
R30  22.77,7.24 90 top
R31  21.5,7.24 90 top
R32  24.04,7.24 90 top
R33  25.31,7.24 90 top
R34  25.05,34.92 180 top
RESET  31.4,42.55 0 top
S1  14.51,5.21 180 top
SJ1  26.45,38.23 180 bottom
SWD  22.26,42.67 0 top
TR1  36.48,27.3 270 top
TR3  40.04,42.04 90 bottom
U$2  62.64,27.94 270 top
U$3  62.64,13.21 270 top
U$5  36.99,14.99 180 top
U$6  18.19,13.21 270 bottom
U$7  36.99,5.33 90 top
U$8  37.88,22.35 90 top
U$9  38.01,30.73 90 top
U$10  22.89,28.57 270 top
U$11  38.01,37.85 90 top
U$13  38.01,42.8 0 top
U$14  49.69,19.3 90 bottom
U$15  49.69,26.42 90 bottom
U$16  58.45,21.97 180 top
U$17  54.52,21.59 90 top
U$18  54.52,28.7 90 top
U$19  58.45,29.08 180 top
U$20  54.52,35.81 90 top
U$21  58.45,36.2 180 top
U$22  49.69,33.53 90 bottom
U$23  25.05,37.72 270 top
UART  10.7,39.24 270 top
USER1  14.51,15.75 0 top
USER2  14.51,20.07 180 top

### Tracks (layer width: path | path; a pad name or v marks a point on that pad's centre or on a via)
3.3V  (via drill 0.4)
  Top 0.178: U$10.52 27.76,25.38 C13.1 | U$10.67 27.99,31.38 C19.2 | U$10.35 19.69,23.85 19.35,23.51 C18.1 19.34,23.35 v19.34,22.61 | U$10.44 23.29,23.86 23.53,23.62 23.53,22.73 v23.27,22.48 | v28.86,26.92 28.72,27.07 C14.1 28.23,28.18 U$10.59 | 19.48,33.78 v18.7,33.78 | 19.48,33.78 C16.2 | U$10.17 19.69,33.62 19.48,33.78 | U$10.24 18.41,29.38 17.83,29.96 C17.1 17.56,30.37 v17.56,30.86
  Top 0.254: R3.2 30.26,16.13 29.12,14.99 29.12,13.97 L2.P$2 | C19.2 28.21,31.37 v28.86,31.37 | C13.1 28.12,25.02 v28.86,25.02
  Top 0.61: C33.1 26.7,9.4 v25.56,10.54
  Top 1.016: L2.P$2 28.61,9.52 C33.1
  Bottom 0.178: v23.27,22.48 19.46,22.48 v19.34,22.61
  Bottom 0.254: U$15.4 48.74,27.95 C36.2 46.78,27.95 46.52,27.69 35.72,27.69 33.31,25.27 29.12,25.27 v28.86,25.02 | U$14.4 48.74,20.84 C37.2 46.78,20.84 46.39,20.45 32.55,20.45 31.66,21.34 25.18,21.34 | U$22.4 48.74,35.07 C35.2 46.78,35.07 46.52,34.8 41.82,34.8 41.31,35.31 30.13,35.31 28.86,34.04 | U$6.3 22.88,12.57 C15.1 23.92,12.56 24.67,11.81 | v23.27,22.48 23.89,22.48 C12.1 24.02,22.48 24.16,22.35 24.16,21.21 24.67,20.7 | 28.86,28.96 27.85,29.97 18.45,29.97 v17.56,30.86 17.56,32.64 v18.7,33.78 | 28.86,34.04 v28.86,31.37 | 28.86,34.04 28.86,36.32 27.21,37.97 SJ1.2
  Bottom 0.406: v28.86,25.02 v28.86,26.92 28.86,28.96 v28.86,31.37
  Bottom 0.61: v26.07,10.03 v25.56,10.54 24.67,11.43 24.67,11.81 24.67,20.7 24.67,20.83 25.18,21.34 v28.86,25.02
+5V  (via drill 0.4)
  Top 0.254: C34.2 32.8,5.93 v32.8,6.48 | v38.01,6.73 38.13,6.6 38.13,6.08 U$7.4
  Top 0.508: L1.P$2 32.64,5.41 C34.2 23.91,5.59 22.32,4 HOLL.1
  Bottom 0.254: v32.8,6.48 33.05,6.73 v38.01,6.73
+12V  (via drill 0.4)
  Top 0.254: U$11.1 35.76,38.82 35.59,38.99 35.09,38.99 | 35.09,38.99 C11.1 35.34,39.27 | v34.32,38.99 35.09,38.99 | U$9.1 35.61,31.71 C9.1 34.49,32.04 v34.32,31.88 v34.32,36.2 | U$8.4 35.46,22.1 34.7,22.86 34.7,23.96 C10.1 34.49,23.92 34.49,23.96 34.32,24.13 v34.32,27.43
  Bottom 0.254: v34.32,27.43 v34.32,31.88 | v34.32,36.2 v34.32,38.99 34.32,40.15 R23.1
AH
  Top 0.178: U$10.61 30.75,28.98 32.04,27.69 32.04,23.24 33.68,21.6 U$8.5
AL
  Top 0.178: U$10.60 30.51,28.57 31.53,27.56 31.53,22.99 33.41,21.1 U$8.6
BH
  Top 0.178: U$10.63 30.57,29.77 31.85,31.06 U$9.2
BL
  Top 0.178: U$10.62 30.8,29.38 31.84,30.41 U$9.3
CAN_RX  (via drill 0.4)
  Top 0.178: v19.72,11.3 19.72,13.97 21.29,15.54 U$10.39
  Bottom 0.178: U$6.4 v19.72,11.3
CAN_TX  (via drill 0.4)
  Top 0.178: 20.23,15.62 20.48,15.88 | 20.23,15.62 v19.72,15.11 | 20.23,15.62 20.89,16.29 U$10.38
  Bottom 0.178: v19.72,15.11 U$6.1
CH
  Top 0.178: U$10.65 29.97,30.57 31.91,32.51 31.91,36.7 33.38,38.17 U$11.2
CL
  Top 0.178: U$10.64 30.21,30.18 32.42,32.38 32.42,36.45 33.49,37.52 U$11.3
GND  (via drill 0.4)
  Top 0.152: U$10.PAD 22.89,28.98 | 23.69,29.38 U$10.PAD | 23.29,28.98 U$10.PAD | 23.69,27.77 U$10.PAD | 24.49,30.18 U$10.PAD
  Top 0.178: U$10.5 24.49,33.48 | U$10.7 23.69,33.44 23.29,33.42 | 23.29,33.42 U$10.8 | U$10.9 22.89,33.4 23.29,33.42 | U$10.58 27.25,27.77 | U$10.45 23.69,24.17 | U$10.43 22.89,24.13 | U$10.25 17.58,28.98
  Top 0.2: 22.89,28.98 U$10.25 | U$10.9 U$10.PAD U$10.43 | 23.69,29.38 U$10.7 | 23.29,28.98 U$10.8 | U$10.58 23.69,27.77 U$10.45 | 24.49,30.18 U$10.5
  other vias: 36.61,15.37 36.61,14.61 36.61,13.84 37.37,15.37 37.37,14.61 37.37,13.84 34.96,12.45 34.96,11.68 32.8,9.02 32.8,9.78 43.21,16.38 43.21,15.62 42.07,14.86 60.1,23.5 59.72,25.4 59.72,24.13 60.48,24.13 60.1,24.77 58.96,25.4 59.34,24.77 58.96,24.13 58.58,24.77 58.2,25.4 57.82,24.77 57.44,25.4 57.06,24.77 56.67,25.4 56.29,24.77 55.91,25.4 59.34,31.88 60.1,30.61 59.72,32.51 60.48,31.24 60.1,31.88 59.72,31.24 58.96,31.24 58.58,31.88 58.96,32.51 58.2,32.51 57.82,31.88 57.44,32.51 57.06,31.88 56.67,32.51 56.29,31.88 55.91,32.51 59.72,39.62 59.72,38.35 60.48,38.35 60.1,38.99 58.96,39.62 59.34,38.99 58.96,38.35 58.58,38.99 58.2,39.62 57.82,38.99 57.44,39.62 57.06,38.99 56.67,39.62 56.29,38.99 55.91,39.62 60.1,37.72 36.99,5.08 36.99,5.84 36.99,4.32 37.5,23.5 37.5,22.73 37.5,21.97 37.5,21.21 38.26,21.21 38.26,21.97 38.26,22.73 38.26,23.5 37.62,30.73 38.39,30.73 38.39,29.97 37.62,29.97 37.62,31.5 38.39,31.5 37.62,37.85 38.39,37.85 37.62,37.08 38.39,37.08 37.62,38.61 38.39,38.61 34.07,22.35 27.85,22.1 26.96,24.51 18.83,24.51 18.83,32.64 26.96,32.64 29.88,31.5 27.21,10.54 26.58,11.18 36.61,34.54 31.4,20.07 39.53,24.77 36.74,24.77 36.61,28.45 31.66,29.21 30.51,27.18 19.72,18.54 20.1,16.64 17.18,27.05 15.53,27.05 10.45,24.51 15.4,28.96 10.45,31.37 20.1,34.8 20.86,36.96 36.1,43.94 1.05,9.78 1.05,12.57 1.05,27.43 1.05,35.18 12.35,2.92 13.24,7.11 60.23,1.02 56.42,4.57 56.42,8.38 56.42,7.62 56.42,6.86 56.42,6.1 56.42,5.33 54.14,5.46 54.14,6.22 54.14,6.99 54.14,7.75 54.14,4.7 45.24,14.73 35.34,29.46 32.93,31.88 35.47,36.2 40.16,36.07 43.72,41.27 20.1,25.78 25.69,25.78 20.1,31.37 25.69,31.37 22.89,31.37 20.1,28.57 22.89,25.78 25.69,28.57 22.89,28.57 64.55,9.78 60.99,10.41 60.87,11.94 61.88,9.53 63.41,9.53 64.42,11.81 59.85,12.19 59.09,12.19 58.33,12.19 57.56,12.19 56.8,12.19 56.42,10.29 60.23,10.29 59.47,11.56 58.71,11.56 57.94,11.56 57.18,11.56 56.42,11.56 57.94,10.29 59.47,10.29 60.23,11.56 59.85,10.92 59.09,10.92 58.33,10.92 57.56,10.92 56.8,10.92 57.18,10.29 58.71,10.29 29.37,18.29 9.81,1.02 20.35,1.02 31.02,1.02 41.31,1.02 53.63,1.02 28.1,43.94 19.97,43.94 8.41,36.7 8.41,8.38 61.5,8.38 28.99,23.75 30.77,24.51 29.24,16.26 33.18,12.06 42.58,10.41 39.66,8.76 42.32,5.97 50.58,5.97 50.45,10.03 45.5,11.56 45.75,5.84 18.32,5.08 11.59,12.06 14.13,8.64 4.99,14.35 4.99,11.94 6.38,22.48 9.18,27.94 12.99,39.24 29.62,35.94 23.27,33.78 26.32,34.67 27.59,36.32 33.43,40.13 33.31,36.2 36.61,39.75 11.59,14.35 14.51,21.34 11.46,20.32 19.34,21.59 17.69,11.3 53.63,31.11 53.63,24 33.31,34.54 31.02,22.1 52.61,32.38 52.74,39.5 52.74,38.48 52.61,25.27 43.21,19.68 39.78,32.51 40.93,28.45 36.61,16.13 37.37,16.13 43.21,26.92 40.16,34.54 43.21,34.04 36.48,26.92 23.66,11.43 23.66,13.59 23.66,20.07 25.69,20.45 25.69,15.62 37.5,19.68 15.53,25.53 16.67,31.62 12.1,34.54 17.56,33.78 15.4,35.94 19.46,41.4 23.27,40.77 28.61,40.39 23.27,37.59 30.51,34.54 30.13,32.64 31.91,37.85 30.51,6.6 36.48,8.76 13.62,3.94 22.13,5.46 20.73,13.84 44.74,43.94 39.53,39.75 60.23,43.94 54.77,43.94 48.55,43.94 45.63,40.77 48.42,40.77 54.77,40.77 60.23,40.77 60.23,5.33 8.67,12.06 8.67,14.35 4.99,16.89 8.67,19.68 6.38,27.81 5.24,33.02 5.49,35.18 5.37,9.78 8.29,32.38 11.59,17.91 16.04,17.91 18.19,14.61 13.75,14.35 13.75,12.06 17.18,20.07 13.11,24.26 13.11,31.62 16.54,39.24 36.48,32.51 12.73,36.2 14.51,33.78 18.32,37.21 32.93,24.51 32.29,28.45 28.23,15.24 47.15,1.02 36.1,1.02 25.81,1.02 14.89,1.02 31.15,4.57 23.27,3.56 28.48,4.32 26.96,8.26 28.23,6.6 20.86,10.03 20.1,7.87 26.2,40.77 26.45,39.75 28.61,37.97 26.58,42.67 31.4,42.42 40.16,40.89 43.09,39.62 40.8,43.81 1.05,31.24
  pour Bottom (isolate 0.254, rank 6, no thermals): 0,0 70,0 70,45 0,45
  pour Top (isolate 0.254, rank 6, no thermals): 70,0 0,0 0,45 70,45
INPWM
  Top 0.178: U$10.14 20.89,35.78 19.21,37.47 18.7,37.97 PMW.3
N$1
  Top 0.178: UART.3 12.1,37.97 18.3,31.77 U$10.18
N$2
  Top 0.178: U$10.34 18.42,25.38 15.15,22.1 11.46,22.1 10.7,21.34 10.7,10.79 11.59,9.91 | S1.8 13.75,7.75 11.59,9.91 | 11.59,9.91 11.21,10.29
N$3  (via drill 0.4)
  Top 0.178: v24.92,8.89 22.89,10.92 22.89,20.45 24.49,22.05 U$10.47
  Top 0.254: v24.92,8.89 24.92,8.27 R33.2
  Bottom 0.254: R29.2 27.34,6.48 v24.92,8.89
N$4  (via drill 0.4)
  Top 0.254: U$21.4 57.4,37.72 v56.17,37.72
  Bottom 0.254: v56.17,37.72 55.28,36.83 46.01,36.83 45.5,36.32 R13.2
N$5  (via drill 0.4)
  Top 0.254: U$11.5 40.76,36.87 v40.93,36.7
  Bottom 0.254: v40.93,36.7 43.34,36.7 43.72,36.32 R13.1
N$6  (via drill 0.4)
  Top 0.254: U$19.4 57.4,30.61 v56.17,30.61
  Bottom 0.254: v56.17,30.61 55.28,29.72 46.01,29.72 45.5,29.21 R11.2
N$7  (via drill 0.4)
  Top 0.254: U$11.7 40.6,38.17 v40.8,38.35
  Bottom 0.254: v40.8,38.35 R12.1
N$8  (via drill 0.4)
  Top 0.254: 57.48,23.49 U$16.4 57.4,23.5 v56.17,23.5
  Bottom 0.254: R9.2 45.5,22.1 46.01,22.61 55.28,22.61 v56.17,23.5
N$9  (via drill 0.4)
  Top 0.254: U$20.4 55.66,36.79 55.66,37.08 v55.02,37.72
  Bottom 0.254: R12.2 45.5,38.35 46.52,37.34 54.64,37.34 v55.02,37.72
N$10  (via drill 0.4)
  Top 0.254: R6.1 51.37,28.45 v50.71,28.45
  Bottom 0.254: v50.71,28.45 50.5,28.25 50.5,27.69 50.57,27.62 U$15.6
  pour Top (isolate 0.254, rank 2, no thermals): 55.02,29.72 51.21,29.72 51.09,29.59 51.09,26.42 51.34,26.16 54.77,26.16 55.02,26.42
N$11  (via drill 0.4)
  Top 0.178: U$10.42 22.49,23.64 v22.77,23.37
  Bottom 0.178: 22,23.66 C21.1 22.22,23.37 v22.77,23.37
N$12
  Top 0.254: U$7.2 38.51,5.08 38.77,4.83 38.77,4.32
  Top 0.813: D3.C C32.2
  pour Top (isolate 0.254, no thermals): 37.75,4.57 37.75,2.67 38.26,2.16 39.66,2.16 39.66,3.68 38.77,4.57
N$13
  Top 1.016: CAN.PIN1 5.11,21.21 5.11,31.37 CAN\.PIN1
N$14
  Top 0.254: U$11.8 40,38.82 40.42,39.24 41.56,39.24 41.82,38.99 41.9,38.99 C8.2
N$15
  Bottom 1.016: CAN.PIN2 5.11,18.71 5.11,28.87 CAN\.PIN2
N$16
  Top 0.254: U$9.8 40.12,31.71 40.42,32 41.58,32 C7.2
N$17
  Top 0.813: CAN.PIN3 1.68,16.08 1.68,26.5 CAN\.PIN3
  Bottom 0.254: U$6.7 14.77,13.84 14.38,13.46 4.3,13.46 CAN.PIN3
N$18
  Top 0.254: U$8.11 40.66,23.1 41.18,23.62 42.47,23.62 C6.2
N$19  (via drill 0.4)
  Top 0.254: R5.1 51.24,35.56 v50.71,35.56
  Bottom 0.254: v50.71,35.56 50.5,35.36 50.5,34.8 50.57,34.73 U$22.6
  pour Top (isolate 0.254, rank 2, no thermals): 55.02,36.83 51.21,36.83 51.09,36.7 51.09,33.53 51.34,33.27 54.77,33.27 55.02,33.53
N$20
  Bottom 0.254: U$6.6 14.77,12.57 14.38,12.95 4.36,12.95 CAN.PIN4
  Bottom 0.813: CAN.PIN4 1.68,13.58 1.68,24 CAN\.PIN4
N$21
  Top 0.254: TR1.2 35.4,26.48 35.85,26.04 35.85,23.62 35.87,23.6 U$8.1
N$22  (via drill 0.4)
  Top 0.254: v33.43,26.92 R20.2 33.38,28.25 TR1.1
  Bottom 0.254: v33.43,26.92 32.8,26.29 R8.1
N$23
  Top 0.178: C23.2 19.23,16.78 20.49,18.05 U$10.37
  Top 0.254: USER1.1 USER1.2 18.15,16.82 C23.2
N$24  (via drill 0.4)
  Top 0.254: U$9.5 40.76,29.76 v40.93,29.59
  Bottom 0.254: v40.93,29.59 43.34,29.59 43.72,29.21 R11.1
N$25  (via drill 0.4)
  Top 0.254: U$18.4 55.71,29.68 55.66,29.73 55.66,29.97 v55.02,30.61
  Bottom 0.254: v55.02,30.61 54.64,30.23 46.52,30.23 45.5,31.24 R10.2
N$26  (via drill 0.4)
  Top 0.254: U$9.7 40.62,31.06 v40.8,31.24
  Bottom 0.254: v40.8,31.24 R10.1
N$27  (via drill 0.4)
  Top 0.254: U$8.8 41.3,21.6 v41.56,21.34
  Bottom 0.254: R9.1 42.2,22.1 41.56,21.46 v41.56,21.34
N$28
  Top 0.254: U$5.2 39.14,14.24 39.53,13.84 39.53,13.72
  pour Top (isolate 0.254, no thermals): 38.26,13.84 40.04,13.84 41.31,12.57 41.31,11.18 38.26,11.18
N$29
  Top 0.254: R2.2 TR1.3
N$30
  Top 0.178: C24.2 19.07,19.04 20.09,20.06 U$10.36
  Top 0.254: USER2.2 USER2.1 18.15,18.99 C24.2
N$31  (via drill 0.4)
  Top 0.254: R7.1 51.24,21.34 v50.71,21.34
  Bottom 0.254: v50.71,21.34 50.63,21.26 50.63,20.57 50.57,20.5 U$14.6
  pour Top (isolate 0.254, rank 2, no thermals): 55.02,22.61 51.21,22.61 51.09,22.48 51.09,19.3 51.34,19.05 54.77,19.05 55.02,19.3
N$32  (via drill 0.4)
  Top 0.178: U$10.11 22.09,40.93 v21.62,41.4
  Bottom 0.178: SWD.5 20.27,41.66 21.37,41.66 v21.62,41.4
N$33
  Top 0.178: U$10.12 21.69,40.32 20.86,41.15 20.86,42.57
  Top 0.2: 20.86,42.57 SWD.4
N$34
  Top 0.178: C27.1 10.49,28.74 10.83,29.08 12.26,29.08 Q1.1 13.27,29.94 15.04,28.18 U$10.27
N$35
  Top 0.178: C28.1 10.49,27.14 10.83,26.8 12.26,26.8 Q1.2 13.27,25.94 15.11,27.77 U$10.28
N$36
  Top 0.254: U$5.4 39.66,15.24 39.91,14.99 C29.1
N$37  (via drill 0.4)
  Top 0.178: U$10.10 22.49,42.18 22.38,42.29 22.38,42.55
  Top 0.2: 22.38,42.55 SWD.3
  Top 0.254: RESET.4 RESET.3 27.89,41.47 C25.1 26.97,41.51 v26.96,41.53
  Bottom 0.254: SWD.3 23.27,41.66 26.83,41.66 v26.96,41.53
N$38
  Top 0.254: U$5.5 39.52,15.74 40.16,16.38 C30.1
N$39
  Top 0.254: U$5.7 34.6,16.24 34.45,16.38 34.31,16.38 R4.2 34.18,16.26 R3.1
N$40
  Top 0.254: U$8.12 40.27,23.6 40.55,23.88 40.55,25.65 C5.1 40.43,26.15 R2.1
  Top 0.406: C5.1 41.18,25.53 D1.C
N$41
  Top 0.178: UART.4 14,35.43 18.06,31.38 U$10.19
N$42
  Top 0.178: U$10.32 17.95,26.18 14.64,22.86 10.95,22.86 9.94,21.84 9.94,10.29 11.97,8.26 11.97,3.94 S1.4
N$43
  Top 0.305: U$5.11 33.19,14.24 32.93,13.97 32.94,13.84 C31.2
  pour Top (isolate 0.254, no thermals): 31.27,14.35 35.72,14.35 35.72,14.1 33.94,14.1 32.16,12.19 32.16,11.94 31.27,11.94
N$44
  Top 0.254: C31.1 33.16,15.13 33.56,14.74 U$5.10
N$45
  Bottom 0.254: TR3.1 38.7,41.09 38.64,41.02 R23.2
N$46
  Top 0.178: U$10.31 17.72,26.57 14.38,23.24 10.7,23.24 9.56,22.1 9.56,8.89 S1.1
N$47  (via drill 0.4)
  Top 0.254: U$7.3 39.31,5.58 C26.2 39.02,6.26 v39.02,6.86
  Bottom 0.254: R21.2 38.26,7.62 v39.02,6.86
N$48  (via drill 0.4)
  Top 0.254: U$17.4 55.66,22.57 55.66,22.86 v55.02,23.5
  Bottom 0.254: v55.02,23.5 54.64,23.11 46.53,23.11 45.52,24.13 R1.2
N$49  (via drill 0.4)
  Top 0.254: U$7.6 35.47,5.58 35.21,5.84 v35.21,7.62
  Bottom 0.254: v35.21,7.62 R21.1
N$50  (via drill 0.4)
  Top 0.254: U$8.10 41.31,22.6 v41.56,22.86
  Bottom 0.254: v41.56,22.86 42.45,22.86 43.72,24.13 R1.1
N$51
  pour Top (isolate 0.254, no thermals): 36.23,4.57 34.7,4.57 34.58,4.45 34.58,3.05 34.83,3.05 34.83,3.81 35.34,4.32 36.1,4.32 36.23,4.45
N$52  (via drill 0.4)
  Top 0.254: R22.B1 40.72,42.21 v40.55,42.04
  Bottom 0.254: TR3.3 v40.55,42.04
N$53  (via drill 0.4)
  Top 0.254: U$13.1 39.47,43.25 v39.66,43.43
  Bottom 0.254: v39.66,43.43 39.28,43.05 38.9,43.05 TR3.2
N$54
  Top 0.254: U$13.3 39.72,42.35 40.25,42.88 R22.A1
N$55  (via drill 0.4)
  Top 0.178: v23.91,8.89 22.51,10.29 22.51,20.7 24.09,22.28 U$10.46
  Top 0.254: v23.91,8.89 23.91,8.02 R32.2
  Bottom 0.254: R26.2 26.07,6.73 v23.91,8.89
N$56
  Top 0.178: U$10.33 18.19,25.77 14.89,22.48 11.21,22.48 10.32,21.59 10.32,10.54 12.48,8.38 12.48,3.94 13.75,2.67 S1.2
N$57  (via drill 0.4)
  Top 0.178: U$10.40 21.69,9.07 v21.88,8.89
  Top 0.254: v21.88,8.89 21.88,8.27 R31.2
  Bottom 0.254: R24.2 21.88,8.27 v21.88,8.89
N$58  (via drill 0.4)
  Top 0.178: U$10.41 22.09,9.69 v22.89,8.89
  Top 0.254: v22.89,8.89 22.89,8.02 R30.2
  Bottom 0.254: R25.2 24.8,6.99 v22.89,8.89
N$59
  Bottom 0.254: HOLL.2 24.16,2.63 24.16,4.06 23.66,4.57 23.66,5.19 R24.1
N$60
  Bottom 0.254: HOLL.3 24.8,2.81 R25.1
N$61
  Bottom 0.254: 26.7,2.4 HOLL.4 26.07,3.04 R26.1
N$62
  Bottom 0.254: R29.1 27.34,3.27 HOLL.5
N$63  (via drill 0.4)
  Top 0.254: SWD.1 25.26,39.93 v25.31,39.88
  Bottom 0.254: v25.31,39.88 25.69,39.5 SJ1.1
N$64
  Top 0.178: R34.A1 25.39,36.84 U$23.1
N$65
  Top 0.178: R34.B1 24.72,36.84 U$23.3
N$66
  Top 0.178: U$10.4 24.89,34.2 24.72,34.37 R34.B2
N$67
  Top 0.178: U$10.3 25.29,34.33 R34.A2
U  (via drill 0.4)
  Top 0.254: U$17.1 56.17,20.69 v55.79,21.72 | v42.58,21.34 C6.1 42.47,22.1 U$8.9 | v55.79,19.43 56.04,19.68 56.04,19.81
  Bottom 0.254: v42.58,21.34 42.83,21.08 46.13,21.08 47.15,22.1 55.41,22.1 v55.79,21.72 55.8,21.7 | R14.2 v55.79,19.43
  pour Top (isolate 0.254, no thermals): 55.53,22.48 60.36,22.48 61.25,23.37 61.25,25.27 61.63,25.65 63.79,25.65 64.17,25.27 64.17,21.46 61.75,19.05 55.79,19.05 55.53,19.3
U_ADC  (via drill 0.4)
  Top 0.178: v29.37,19.43 28.73,19.43 25.29,22.87 U$10.49
  Bottom 0.254: v29.37,19.43 30.39,18.41 46.52,18.41 47.91,17.02 52.61,17.02 53.75,18.16 R15.2 R14.1
U_I_ADC  (via drill 0.4)
  Top 0.178: v30.39,19.43 29.62,20.19 28.61,20.19 25.69,23.11 U$10.50
  Bottom 0.254: U$14.3 47.59,18.1 46.77,18.92 30.89,18.92 v30.39,19.43
V  (via drill 0.4)
  Top 0.254: U$9.6 41.63,30.41 41.69,30.48 41.96,30.48 C7.1 v41.94,28.7 | U$18.1 56.17,27.8 v55.79,28.83 | v55.79,26.54 55.79,26.67 55.91,26.8
  Bottom 0.254: v41.94,28.7 42.45,28.19 46.13,28.19 47.15,29.21 55.41,29.21 v55.79,28.83 55.8,28.81 | R16.2 v55.79,26.54
  pour Top (isolate 0.254, no thermals): 55.53,29.59 55.53,26.42 55.79,26.16 63.79,26.16 64.17,26.54 64.17,29.21 63.79,29.59
V_ADC  (via drill 0.4)
  Top 0.178: v30.01,22.86 26.58,22.86 26.09,23.34 U$10.51
  Bottom 0.254: R16.1 R17.2 53.74,25.26 52.61,24.13 47.91,24.13 46.39,25.65 36.23,25.65 33.69,23.11 30.26,23.11 v30.01,22.86
V_I_ADC  (via drill 0.4)
  Top 0.178: U$10.53 29.12,25.77 29.62,25.27 29.62,24.26 v30.01,23.88
  Bottom 0.254: U$15.3 47.59,25.22 46.64,26.16 35.97,26.16 33.56,23.75 30.13,23.75 v30.01,23.88
VCC_1  (via drill 0.4)
  Top 0.178: U$10.26 16.8,28.57 v16.42,28.96 | v27.85,26.92 27.4,27.38 U$10.57
  Bottom 0.254: v16.42,28.96 16.92,29.46 21.37,29.46 | v27.85,26.92 27.85,27.81 26.2,29.46 21.37,29.46 | C20.1 21.5,29.34 21.37,29.46
VDD  (via drill 0.4)
  Top 0.254: R7.2 49.16,21.34 v49.69,21.34 | R6.2 49.03,28.45 v49.69,28.45 | R5.2 49.16,35.56 v49.69,35.56 | R22.A2 44.02,42.88 44.74,42.16 44.74,41.4 | 44.74,41.4 44.74,39.88 44.86,39.75 | R22.B2 43.93,42.21 44.74,41.4
  Top 0.813: D2.A D3.A
  Top 1.27: D2.A 45.3,13.46 49.69,13.46
  Bottom 0.254: v49.69,21.34 49.83,21.2 49.83,20.57 49.76,20.5 U$14.5 | v49.69,28.45 49.83,28.31 49.83,27.69 49.76,27.62 U$15.5 | v49.69,35.56 49.83,35.42 49.83,34.8 49.76,34.73 U$22.5 | R28.2 C39.+
  pour Top (isolate 0.254, rank 4, no thermals): 63.66,12.95 48.17,12.95 44.1,17.02 44.1,39.24 44.74,39.88 49.31,39.88 49.31,20.07 51.34,18.03 63.41,18.03 64.17,17.27 64.17,13.46
VDD_ADC  (via drill 0.4)
  Top 0.178: v28.35,18.03 28.35,19.18 27.97,19.56 24.89,22.64 U$10.48
  Bottom 0.254: v28.35,18.03 29.24,17.14 44.99,17.14 47.9,14.24 R28.1 49.55,12.86 R27.2
VDDEN  (via drill 0.4)
  Top 0.178: U$10.54 29.64,26.18 v29.75,26.29
  Bottom 0.254: v29.75,26.29 R8.2
W  (via drill 0.4)
  Top 0.254: U$11.6 41.63,37.52 41.82,37.72 41.87,37.72 C8.1 v41.94,35.94 | U$20.1 U$20.2 v55.79,35.94 | v55.79,33.66 55.91,33.78 55.91,33.91
  Bottom 0.254: v55.79,35.94 55.41,36.32 47.15,36.32 46.13,35.31 42.58,35.31 v41.94,35.94 | R18.2 v55.79,33.66
  pour Top (isolate 0.254, no thermals): 55.53,36.7 55.53,33.53 55.79,33.27 60.36,33.27 61.25,32.38 61.25,30.48 61.63,30.1 63.79,30.1 64.17,30.48 64.17,34.29 61.75,36.7
W_ADC  (via drill 0.4)
  Top 0.178: v31.15,32.77 30.51,33.4 26.45,33.4 26.09,33.05 U$10.1
  Bottom 0.254: R18.1 R19.2 53.74,32.37 52.61,31.24 47.91,31.24 46.39,32.77 40.8,32.77 40.29,33.27 32.55,33.27 32.04,32.77 v31.15,32.77
W_I_ADC  (via drill 0.4)
  Top 0.178: U$10.2 25.69,33.28 26.2,33.78 v31.15,33.78
  Bottom 0.254: U$22.3 47.59,32.33 46.64,33.27 41.05,33.27 40.55,33.78 v31.15,33.78